# Altium schematic sheet ade7753.SchDoc
size A; SheetNumber: 2; SheetTotal: 3
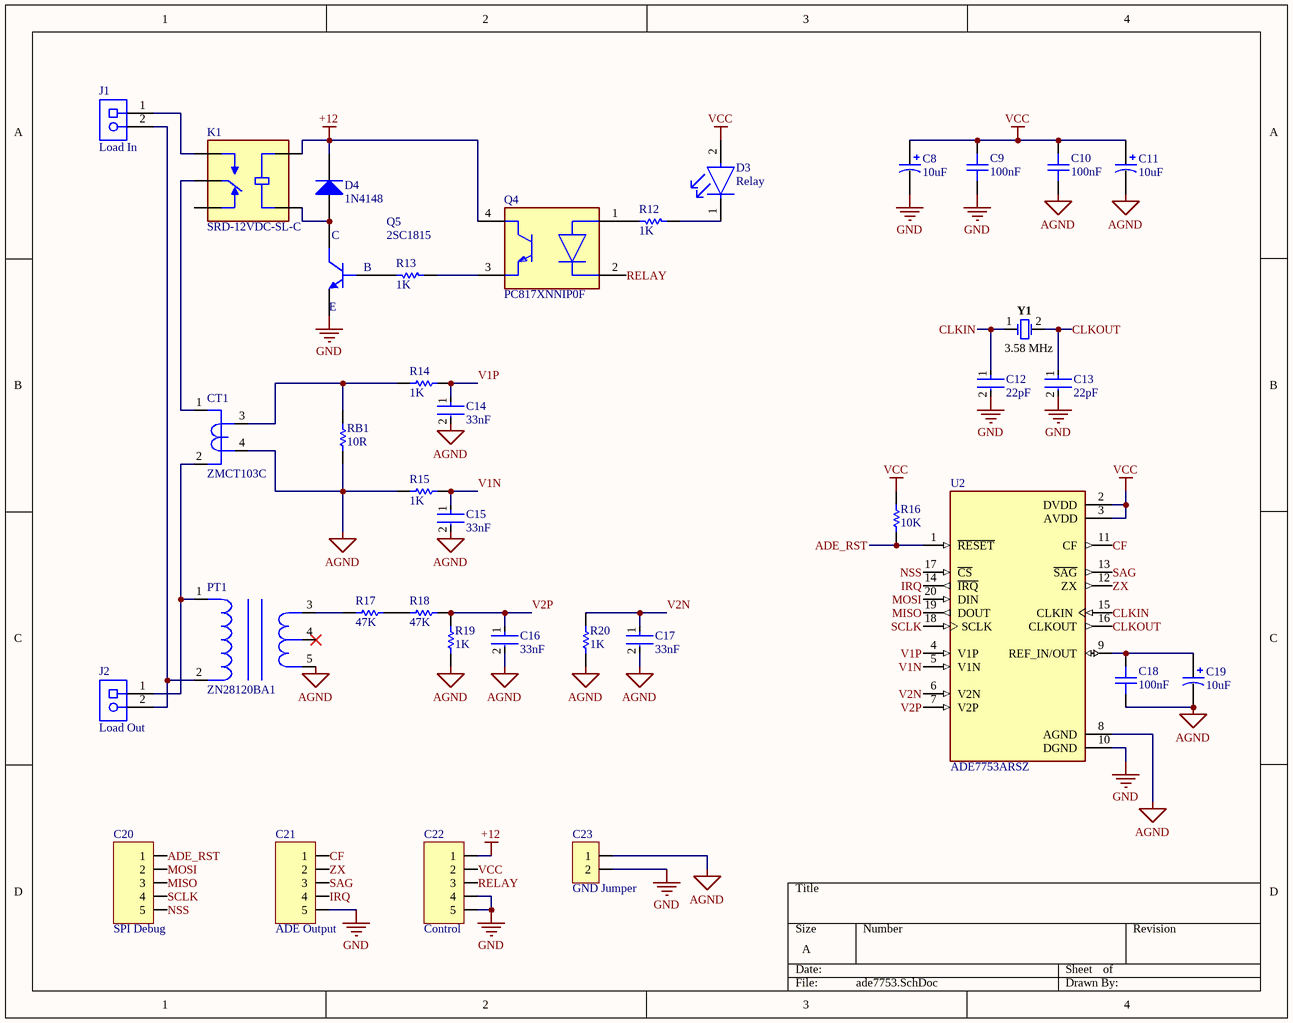
[diagram p0: ade7753.SchDoc]

## Parts
C8  10uF  [CAP_ALUM_D050_S20_H110]
C9  100nF  [CAP_CER_TH100]
C10  100nF  [CAP_CER_TH100]
C11  10uF  [CAP_ALUM_D050_S20_H110]
C12  22pF  [FP-0603-L_1_6_0_15-W_0_81-IPC_A]
C13  22pF  [FP-0603-L_1_6_0_15-W_0_81-IPC_A]
C14  33nF  [FP-C0805C-DN-IPC_A]
C15  33nF  [FP-C0805C-DN-IPC_A]
C16  33nF  [FP-C0805C-DN-IPC_A]
C17  33nF  [FP-C0805C-DN-IPC_A]
C18  100nF  [CAP_CER_TH100]
C19  10uF  [CAP_ALUM_D050_S20_H110]
C20  SPI Debug  [JP5-D1T]
C21  ADE Output  [JP5-D1T]
C22  Control  [JP5-D1T]
C23  GND Jumper  [JP2-CLOSED]
CT1  ZMCT103C  [ZMCT103C]
D3  Relay  [FP-HLMP-4700-MFG]
D4  1N4148  [NXP-SOD27-2_V]
J1  Load In  [PHOE-1729128-2_V]
J2  Load Out  [PHOE-1729128-2_V]
K1  SRD-12VDC-SL-C  [RELAY_SRD-12VDC-SL-C]
PT1  ZN28120BA1  [ZN28120BA1]
Q4  PC817XNNIP0F  [FP-PC817XNNIP0F-MFG]
Q5  2SC1815  [SOT23_3]
R12  1K  [RESC1609X55X30ML15T15]
R13  1K  [RESC1609X55X30ML15T15]
R14  1K  [RESC1609X55X30ML15T15]
R15  1K  [RESC1609X55X30ML15T15]
R16  10K  [RESC1609X55X30ML15T15]
R17  47K  [RESC1609X55X30ML15T15]
R18  47K  [RESC1609X55X30ML15T15]
R19  1K  [RESC1609X55X30ML15T15]
R20  1K  [RESC1609X55X30ML15T15]
RB1  10R  [RESC1609X55X30ML15T15]
U2  ADE7753ARSZ  [SOP65P780X200-20N]
Y1  3.58 MHz  [FOX-FOXSLF-2_V]

## Nets
+12: C22.1 D4.2(K) K1.COIL2 Q4.4(C)
AGND: C10.1 C11.2 C14.2 C15.2 C16.2 C17.2 C18.1 C19.2 C23.1 CT1.4 PT1.5 R15.1 R19.1 R20.1 RB1.2 U2.8(AGND)
GND: C8.2 C9.1 C12.2 C13.2 C21.5 C22.4 C22.5 C23.2 Q5.2(E) U2.10(DGND)
VCC: C8.1 C9.2 C10.2 C11.1 C22.2 D3.2(A) R16.2 U2.2(DVDD) U2.3(AVDD)
ADE_RST: C20.1 R16.1 U2.1(~{RESET})
CF: C21.1 U2.11(CF)
CLKIN: C12.1 U2.15(CLKIN) Y1.1
CLKOUT: C13.1 U2.16(CLKOUT) Y1.2
IRQ: C21.4 U2.14(~{IRQ})
MISO: C20.3 U2.19(DOUT)
MOSI: C20.2 U2.20(DIN)
NSS: C20.5 U2.17(~{CS})
RELAY: C22.3 Q4.2(C)
SAG: C21.3 U2.13(~{SAG})
SCLK: C20.4 U2.18(SCLK)
V1N: C15.1 R15.2 U2.5(V1N)
V1P: C14.1 R14.2 U2.4(V1P)
V2N: C17.1 R20.2 U2.6(V2N)
V2P: C16.1 R18.1 R19.2 U2.7(V2P)
ZX: C21.2 U2.12(ZX)
NetC18_2: C18.2 C19.1 U2.9(REF_IN/OUT)
NetCT1_1: CT1.1 K1.COM
NetCT1_2: CT1.2 J2.1 PT1.1
NetCT1_3: CT1.3 R14.1 RB1.1
NetD3_1: D3.1(C) R12.1
NetD4_1: D4.1(A) K1.COIL1 Q5.3(C)
NetJ1_1: J1.1 K1.NO
NetJ1_2: J1.2 J2.2 PT1.2
NetPT1_3: PT1.3 R17.2
NetQ4_1: Q4.1(A) R12.2
NetQ4_3: Q4.3(E) R13.1
NetQ5_1: Q5.1(B) R13.2
NetR17_1: R17.1 R18.2

Not connected (* = marked no-connect by the designer): K1 NC; PT1 4*

## Library data of the parts
C8 C11 C19 = 106CKR050M: CAP ALUM 10uF 50V 20% RADIAL; Value: 106/50V; Solder: WAVE; CompanyID: VT-00054; MPN: 106CKR050M; Category: CAPACITOR; PinCount: 2
C9 C10 C18 = K104Z15Y5VF5TL2: CAP CER 0.1uF -20 +80% 50V Y5V RADIAL; CompanyID: VT-00189; Solder: WAVE; Value: 104/50V; MPN: K104Z15Y5VF5TL2; Category: CAPACITOR; PinCount: 2
C12 C13 = CMP-2006-04207-3: General Purpose Ceramic Capacitor, 0603, 22pF, 5%, NP0, 30ppm/°C, 50V; Dielectric: C0G; Insulation Resistance: 100GR; Termination: SMD/SMT; Lead Free: Lead Free; Package Quantity: 1; Thickness: 0.035inch; Packaging: Tape and Reel; Radiation Hardening: No; Voltage Rating: 50V; Depth: 0.81mm; Case Code (Metric): 1608; Min Operating Temperature: -55°C; Number of Pins: 2; REACH SVHC: No SVHC; RoHS Compliant: Yes; Mount: Surface Mount; Case/Package: 0603; Width: 0.81mm; Case Code (Imperial): 0603; Max Operating Temperature: 125°C; Contact Plating: Tin; Temperature Coefficient: 30ppm/°C; Voltage Rating (DC): 50V; Height: 0.63mm; Dielectric Material: Ceramic; Capacitance: 22pF; Voltage: 50V; Length: 1.6mm; Tolerance: 5%
C14-C17 = CMP-2007-00375-2: CAP CER 0.033UF 50V X7R 0805; Manufacturer: KEMET; Manufacturer Part Number: C0805C333K5RACTU; Tolerance: 0.1; Value: 33,000 pF; Temperature Coefficient: 30ppm/°C; Material: Ceramic; Device Class L1: Passive Components; ComponentLink2Description: Datasheet; Temperature: -55°C to +125°C; Temperature Range High: +125°C; Package: C0805C-DN; Device Class L3: Ceramic Capacitors; Device Class L2: Capacitors; Digikey Description: CAP CER 0.033UF 50V X7R 0805; Category: Cap; Height: 0.88mm; ComponentLink2URL: https://content.kemet.com/datasheets/KEM_C1003_C0G_SMD.pdf; Mouser Description: Multilayer Ceramic Capacitors (MLCC) - SMD/SMT 50volts 33000pF X7R 10%; Octopart: https://octopart.com/c0805c333k5ractu-kemet-142441; Capacitance: 33,000 pF; Temperature Range Low: -55°C; Voltage Rating: 50 V; Temperature Characteristic: X7R; RoHS: TRUE; Automotive: No; Ipc Land Pattern Name: CAPC200125X78; Lead Free: Yes
C20-C22 = JP5: WR-PHD 2.54 mm Angled Socket Header; Manufacturer: W¨¹rth Elektronik eiSos GmbH; partNo: 613005143121; ComponentLink1 Description: Manufacturer; ComponentLink2 Description: Datasheet; NoPins: 05; Created Date: 29 March 2013; ComponentLink1URL: http://www.we-online.com; ComponentLink2URL: http://katalog.we-online.de/em/datasheet/6130xx143121.pdf; Created by: Karrer Zheng
C23 = JP2: WR-PHD 2.54 mm Angled Socket Header; Manufacturer: W¨¹rth Elektronik eiSos GmbH; partNo: 613002143121; ComponentLink1 Description: Manufacturer; ComponentLink2 Description: Datasheet; NoPins: 02; Created Date: 29 March 2013; ComponentLink1URL: http://www.we-online.com; ComponentLink2URL: http://katalog.we-online.de/em/datasheet/6130xx143121.pdf; Created by: Karrer Zheng
CT1 = ZMCT103C: ZMCT103C Current Transformer 1000:1 5A/5mA
D3 = CMP-18399-000008-1: LED RED DIFFUSED T-1 3/4 T/H; Manufacturer: Broadcom; Luminous Intensity: 2.3mcd; Peak Emmision Wavelength: 635nm; Forward Voltage: 1.7V; Viewing Angle: 50°; Led Orientation: Straight; Reverse Voltage: 5V; Forward Current: 2mA; Power Dissipation: 14mW; Wavelength: 626nm; Digikey Description: LED RED DIFFUSED T-1 3/4 T/H; Device Class L3: unset; Temperature Range Low: -40°C; Temperature Range High: +100°C; RoHS: TRUE; Package: HLMP-4700; Octopart: https://octopart.com/hlmp-4700-broadcom-71130526; Automotive: No; ComponentLink2URL: https://docs.broadcom.com/docs/AV02-1557EN; Colour: Red; Temperature: -40°C to +100°C; Lead Free: Yes; Category: Diode; ComponentLink2Description: Datasheet; Manufacturer Part Number: HLMP-4700; Device Class L1: Optoelectronics; Device Class L2: LEDs; Mouser Description: LED; Red; 2.3mcd; 0.24In.Dia.; T-1-3/4; 500mA; 1.7V; 635nm; 50deg; 5V; 24mW; -55degC;
D4 = CMP-0648-00002-1: High-speed Diode, 100 V, 450 mA, 2-Pin SOD27, RoHS; Manufacturer: NXP Semiconductors; Configuration: Single; IR (VR: 20 V)=25 nA; IFRM: 450 mA; IFSM: 4 A Max.; Trr: 4 ns Max.; Cd: 4 pF Max.; VR: 100 V Max.; VF (IF: 10 mA)=1 V; IF: 200 mA Max.; ComponentLink1Description: Manufacturer URL; RoHS: TRUE; ComponentLink1URL: http://www.nxp.com/; ComponentLink3Description: Package Specification; DatasheetVersion: Aug-04; ComponentLink2Description: Datasheet; PackageVersion: Aug-04; PackageReference: SOD27; ComponentLink3URL: http://www.nxp.com/documents/data_sheet/1N4148_1N4448.pdf; Mounting Technology: Through Hole; ComponentLink2URL: http://www.nxp.com/documents/data_sheet/1N4148_1N4448.pdf; PartNumber: 1N4148; PackageDescription: 2-Pin Hermetically Sealed Glass Package, Axial Leaded, Dia 1.85 mm, Body Length 4.25 mm, Lead Spread 25.4 mm
J1 J2 = CMP-2000-05815-1: PCB Terminal Block, 13.5 A, 400 V, 2-Pin THD, RoHS, Bulk; PartNumber: 1729128; Manufacturer: Phoenix Contact; Package Version: 03/2015; No. of Rows: 1; Pitch: 5.08mm; No. of Positions: 2; Voltage Rating: 400V; Current Rating: 13500mA; Manufacturer URL: http://www.phoenixcontact.com/; Datasheet URL: https://datasheet.ciiva.com/16046/1729128-16046181.pdf; RoHS: TRUE; Package URL: https://www.phoenixcontact.com/online/portal/pi/pxc/product_detail_page/!ut/p/b1/3VdJjqNKFDxLH8AFycySyWY2ozFsEPOMMQaDOX1XedGL_1Vdm5YXJleknhSKeBkvI6EA8ncAo3AYoDhBQGco6KN7VURTdemj9us_IEKEZo_YHiPAEWEFmDGOHMORkqKYCORBZxgL7ZoaZYcbFFUZ3fqxSY6GOuxydWUuHqz1ynmMFygu583Bob0Ewr6Sd_l-5m-kAueHiB0jpRwZwe58wwtkpxtMYd_LmGcDRU02dRNEyWt6Y2ti5pSyJ_reIkzIulrqApdnbT11V5jnCKbYNCvhEM1MCpPByat_X379-iThf08CI5GfOPqfBeS3BRoBOdD55AKVv0iLwCMq-2BrzXWSGRH7pUGD9uwXQjiph3xL0DKQwdGa0JImiIOmBNOestqgwTHSSs2oOep-78apyXQBvNi8ZLaFjvjWvcaUEBu0MC6Wbe-d6mB0FAebo2lUWinqYaZs5DAYzV0RP9yitUjnGJ0iI9xhZkT42OCQNUJJhkgWINNQLP2JFP6OpMg3JCVg70jqHT0lvKOnhHf0lPuOnnLf0VPuWx6_dxwUIvwk5WMkT0kLL1mh61l2yZVSzG3pYV_bqo-mj6uMKwKwdnnW8Jh5RTOJzMOA5c-eJDaZQw4mTMPH02PvS_ZAqNVjVTo2WyYLkwH_KU1mmmG5kjRhDqPXLwwVHvVOjCM60-fpXvTDfMGW1PVFVS1r4e4yVDk4ZdNbkUHvqPqQSeian4UD39fNKmachqdJ1NJbyk8rXT9mXTvPk3oE5meulKGgiruPJek-4I9hTT6G8ZLOyRSm2RRVbThERQad5OS28hdt4YW4vG0stgYYzsWsK4_7y6DZMjJSCqri1kyiZR5vD7pwIrNR7QwPHTcLTI5qT7eRlpHrdGiupYlqQDJ7zy_CND8fWWBoLRXxk1RVcXiBQwbTD4Xi7KL-FuO94t9xaqweXzH; Package Description: 2-Pin Through Hole Device, Body 8.1 x 10.16 mm, Pitch 5.08 mm; Datasheet Version: 12/2013; Mounting Technology: ThroughHole; Orientation: Horizontal; Package Reference: 1729128-2; Packing: Bulk
K1 = SRD-12VDC-SL-C: General Purpose Non Latching 12VDC SPDT Through Hole Relays RoHS; MF: {'manufacturer': u'Songle Relay'}; Availability: Unavailable; Price: None; Package: None; Value: *; MP: SRD-12VDC-SL-C
PT1 = EI28 ZN28120BA1: 220VAC / 12VAC EI28 ZN28120BA1
Q4 = CMP-65434-000005-1: OPTOISOLATOR 5KV TRANS 4SMD; Reverse Breakdown Voltage: 6V; Output Current per Channel: 30mA; Power Dissipation: 200mW; Collector-emitter Voltage-Max: 200mV; Max Output Voltage: 80V; Input Current: 50mA; Forward Voltage: 1.4V; Fall Time: 18000ns; Number of Elements: 1; Input Type: DC; Packaging: Tape and Reel; RoHS Compliant: Yes; Contact Plating: Copper; Min Operating Temperature: -30°C; Collector Emitter Saturation Voltage: 200mV; Max Input Current: 50mA; Radiation Hardening: No; Max Collector Current: 50mA; Case/Package: SMD/SMT; Mount: Surface Mount; Output Voltage: 80V; Forward Current: 50mA; Max Power Dissipation: 200mW; Collector Emitter Voltage (VCEO): 80V; Number of Channels: 1; Rise Time: 18000ns; Isolation Voltage: 5kV; Number of Pins: 4; Lead Free: Lead Free; Package Quantity: 2000; Isolation Voltage-Max: 5kV; Max Operating Temperature: 100°C
Q5 = 2SC1815: TRANS NPN 50V 0.15A SOT23-3; Solder: SMT; MPN: 2SC1815; Value: 2SC1815
R12-R20 RB1 = CMP-1012-00623-3: Chip Resistor, 10 KOhm, +/- 1%, 0.1 W, -55 to 155 degC, 0603 (1608 Metric), RoHS, Tape and Reel; Manufacturer: Panasonic; Voltage Rating: 75V; Case\/Package: 0603; Power Rating: 100mW; Resistance: 10KOhm; Temperature Coefficient: 100ppm\/degreesC; Number of Pins: 2; Package Reference: 603; Depth: 0.8mm; Mount: SurfaceMount; Package Description: 2-Pin Surface Mount Device, Body 1.6 x 0.85 mm; Datasheet Version: 02/2017; Length: 1.6mm; Lead Free: LeadFree; Height: 0.45mm; Number of Terminations: 2; Max Power Dissipation: 100mW; Min Operating Temperature: -55degC; Datasheet URL: https://industrial.panasonic.com/cdbs/www-data/pdf/RDA0000/AOA0000C304.pdf; Termination: SMD/SMT; Case Code (Metric): 1608; Case Code (Imperial): 0603; Tolerance: 1%; Max Operating Temperature: 155degC; RoHSCompliant: true; Voltage Rating (DC): 75V; Radiation Hardening: No; Packaging: TapeandReel; Composition: ThickFilm; Mounting Technology: SurfaceMount; Manufacturer URL: http://www.panasonic.com/; Width: 0.031inch; REACH SVHC: NoSVHC; Contact Plating: Tin; Military Standard: Not; Package Quantity: 1
U2 = ADE7753ARSZ: Single Phase Multifunction Metering IC 20-Pin SSOP Tube; MF: {'manufacturer': u'Analog Devices'}; Value: *; MP: ADE7753ARSZ; Package: None; Price: None; Availability: Unavailable
Y1 = CMP-1749-00004-1: Resistance Weld Thru-Hole Crystal, 12 MHz, +/-30 ppm, -20 to 70 degC, 2-Pin THD, RoHS, Bulk; Elements: 1; Rds On Max: 115 mohm; Typical Rise Time: 90 ns; Max Power Dissipation: 2.5 W; Case\Package: TO-251-3; Input Capacitance: 350 pF; REACH SVHC: No SVHC; Length: 6.6 mm; ComponentLink1URL: http://www.foxonline.com/; PackageDescription: 2-Pin Through Hole Device, Body 11.35 x 4.65 mm, Pitch 4.88 mm; Radiation Hardening: No; Package Quantity: 70; Packaging: Rail/Tube; ComponentLink1Description: Manufacturer URL; Min Operating Temperature: -55 degC; Max Operating Temperature: 150 degC; RoHSCompliant: true; PackageReference: FOXSLF-2; DatasheetVersion: Mar-15; Pins: 3; Height: 6.1 mm; Mount: Through Hole; ComponentLink2URL: http://www.foxonline.com/pdfs/hc49slf.pdf; ComponentLink2Description: Datasheet; Width: 2.3 mm